# Altium schematic sheet 505147_2_1.SchDoc
size Letter; CheckedBy: BC; DrawnBy: BC; Organization: space-eight.com; Address1: 343 NW 84th St; Address2: Seattle, WA; Address3: 98117; Address4: USA; DocumentNumber: 505XXX; Revision: 1; phone: (323) 791-6991; SP: SP11XXXX; Description: CIRCUIT BOARD; Revdate: --
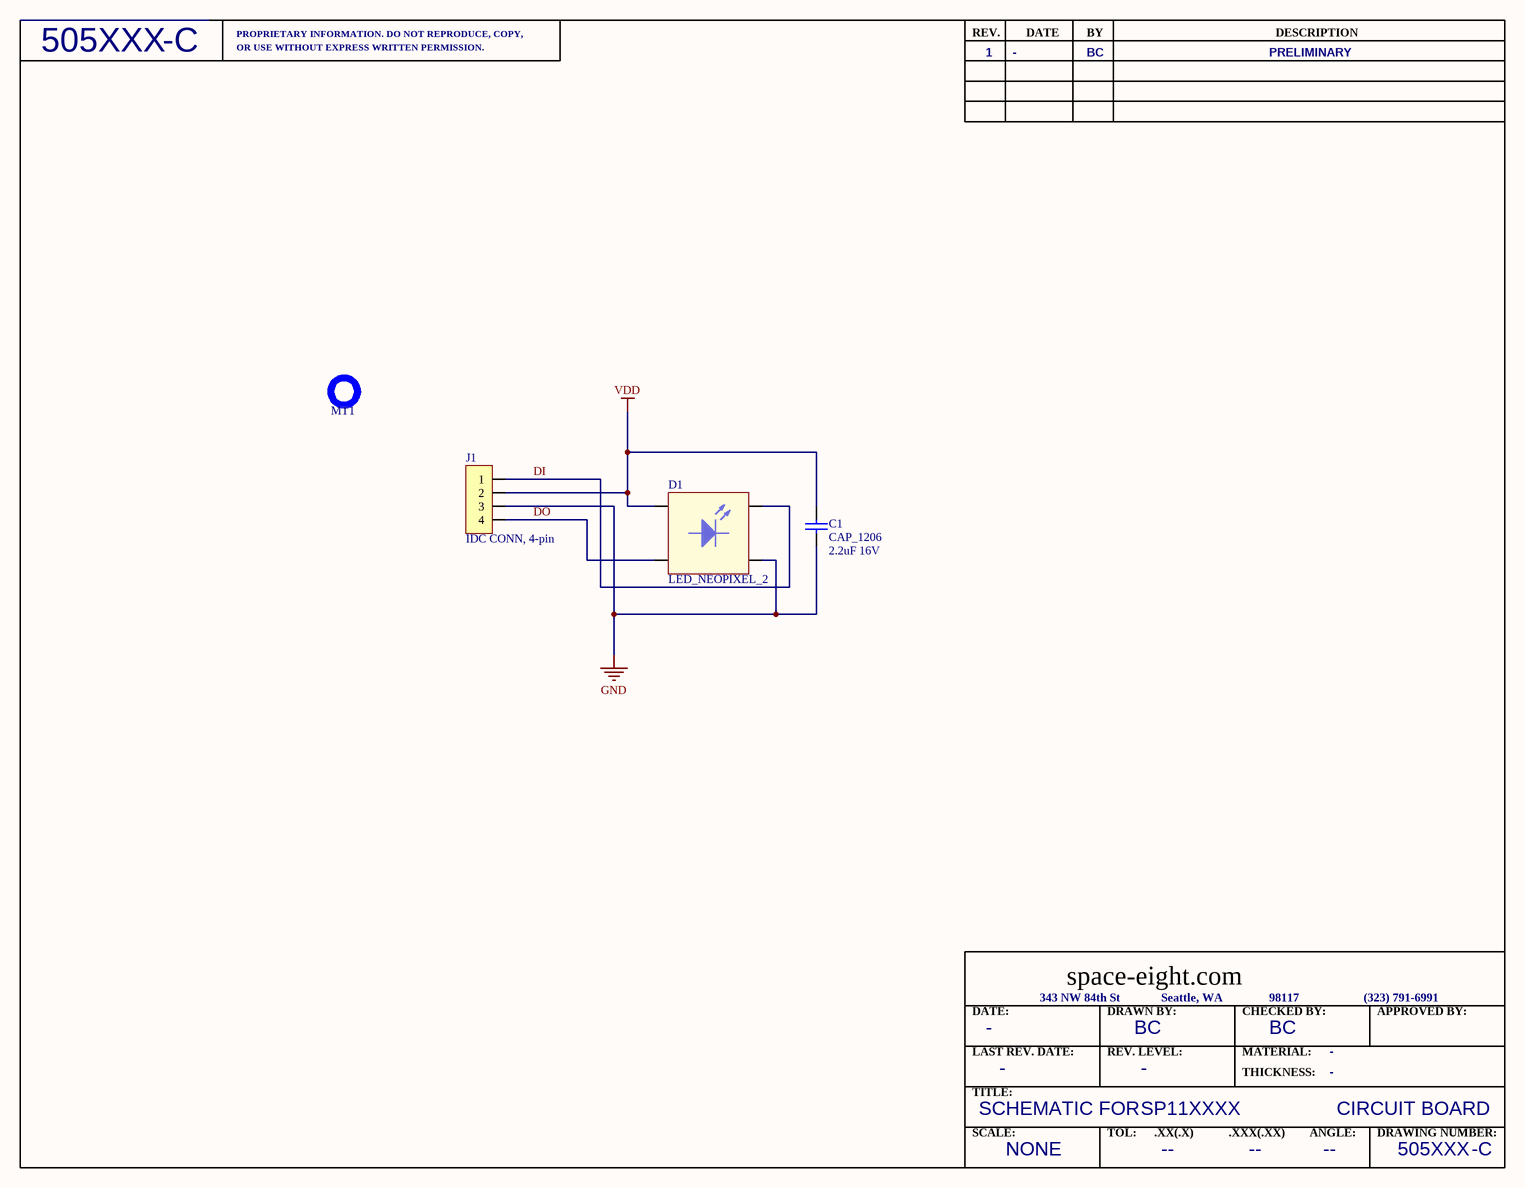
[diagram p0: 505147_2_1.SchDoc]

## Parts
C1  CAP_1206  value 2.2uF 16V  [SMT_1206_MOD]
D1  LED_NEOPIXEL_2  [NEOPIXEL_2]
J1  IDC CONN, 4-pin  [IDC_CONN_SMT_4-PIN]
MT1  MOUNTING HOLE  [MOUNTING HOLE]  (value not drawn)

## Nets
GND: C1.1 D1.1(GND) J1.3
VDD: C1.2 D1.3(VDD) J1.2
DI: D1.2(DI) J1.1
DO: D1.4(DO) J1.4

## Notes on the sheet
- PROPRIETARY INFORMATION. DO NOT REPRODUCE, COPY,
- REV.
- DATE
- BY
- DESCRIPTION
- -C
- OR USE WITHOUT EXPRESS WRITTEN PERMISSION.
- 1
- -
- BC
- PRELIMINARY
- LAST REV. DATE:
- DATE:
- REV. LEVEL:
- DRAWN BY:
- MATERIAL:
- CHECKED BY:
- APPROVED BY:
- TITLE:
- SCHEMATIC FOR
- THICKNESS:
- SCALE:
- NONE
- TOL:
- .XX(.X)
- --
- .XXX(.XX)
- ANGLE:
- DRAWING NUMBER:

## Library data of the parts
C1 = CAP_1206: CAP; Manufacturer: Generic Components; Class I: Passive; Class II: Capacitor; Published: 8-Jun-2000; Revision: July-2002: Re-released for DXP Platform.; Publisher: Altium Limited
D1 = LED_NEOPIXEL_2: RGB NEOPIXEL; Manufacturer: Generic Components; Class I: Optoelectronic; Class II: LED; Published: 8-Jun-2000; Revision: July-2002: Re-released for DXP Platform.; Publisher: Altium Limited
J1 = IDC CONN, 4-pin: ICD Connector, 4-Pin; Revision: 17-Jul-2002: Re-released for DXP Platform.; Publisher: Altium Limited